# EAGLE design boat4 (EAGLE 6.4)
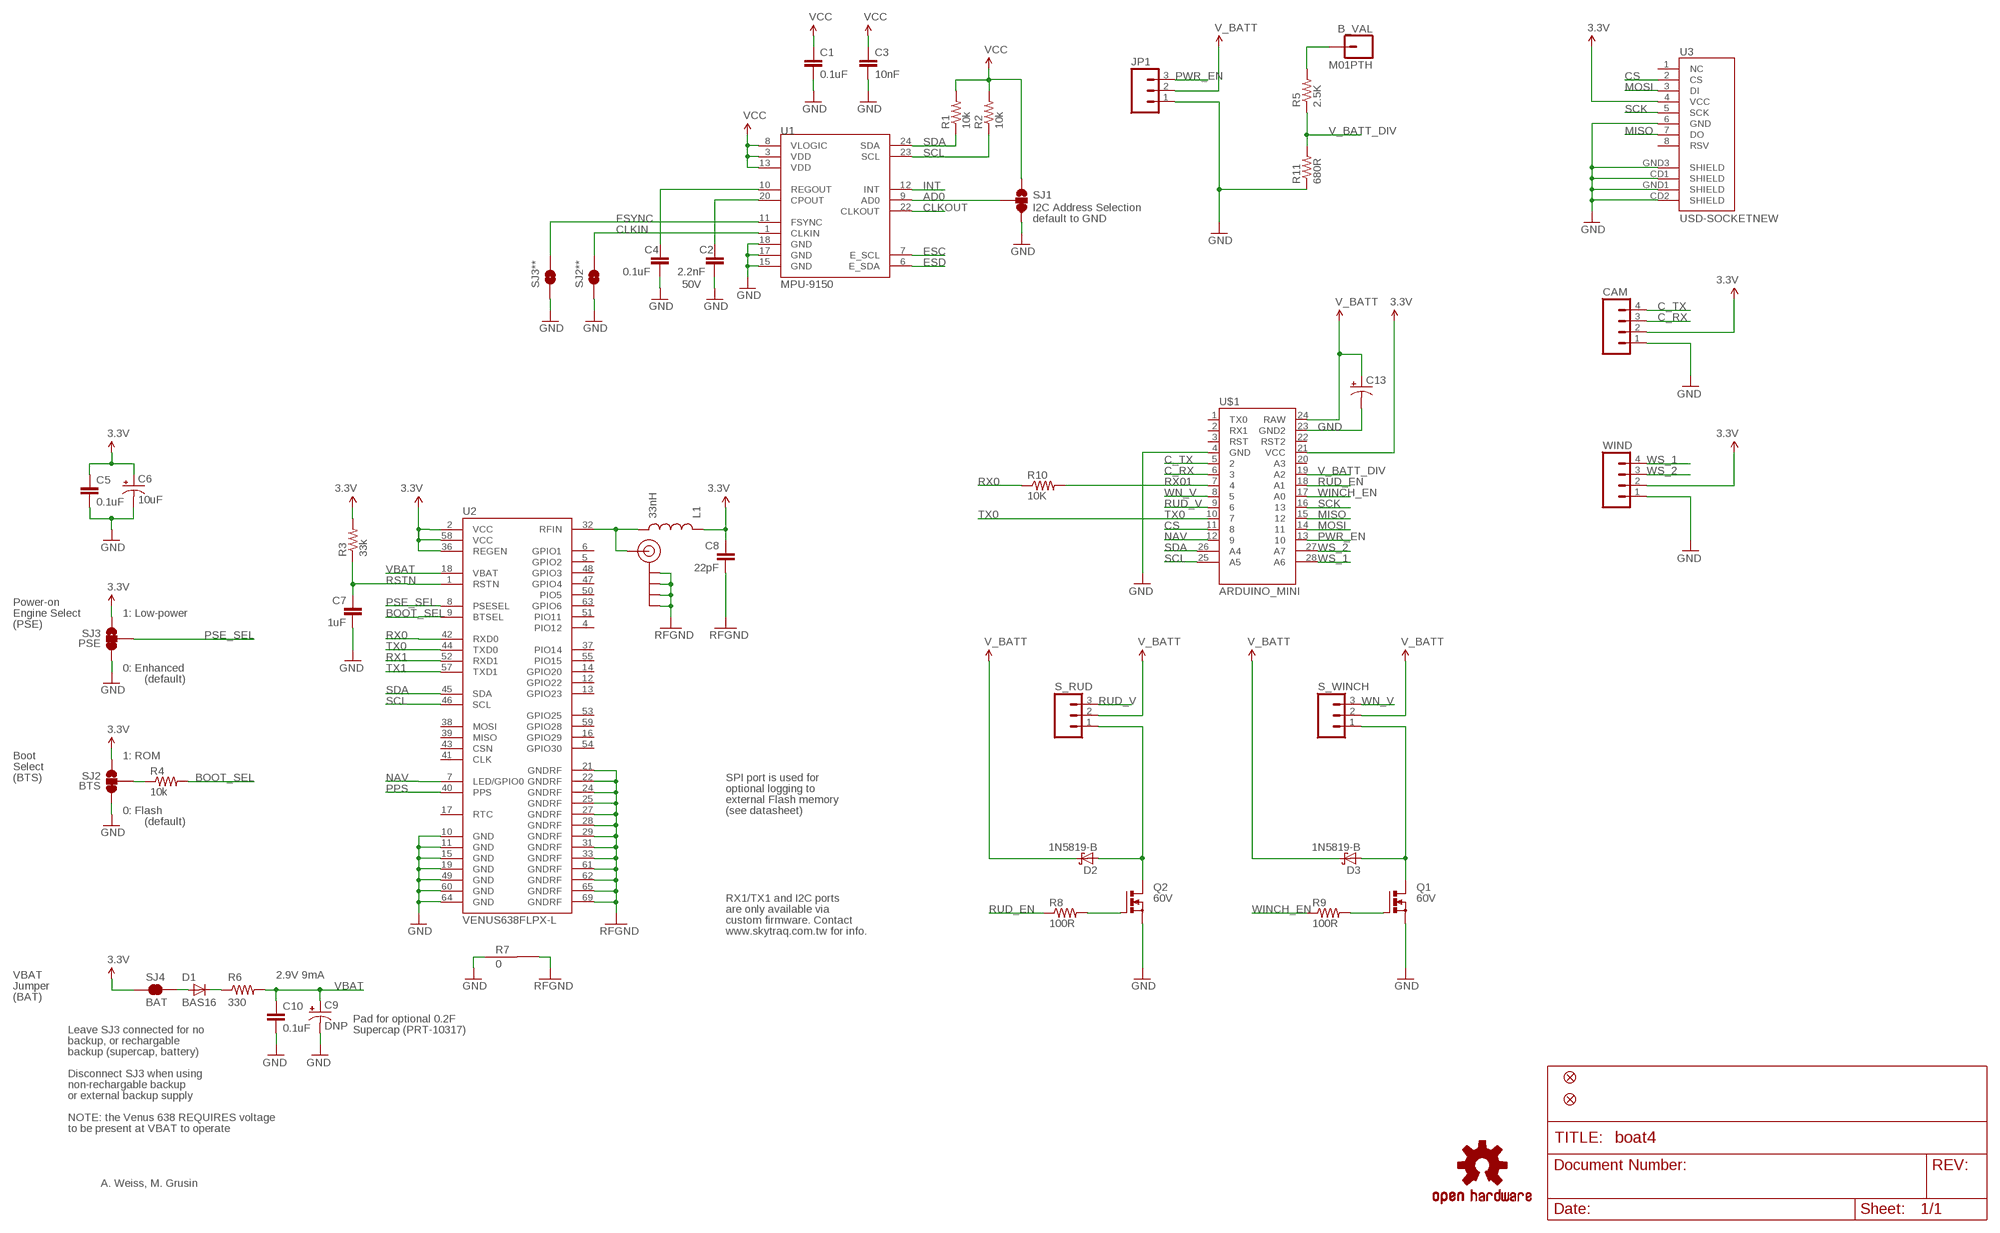
[diagram p0: schematic, sheet 1]

## Parts
B_VAL  M01PTH  [1X01]
C1  0.1uF  CAP0402-CAP  [0402-CAP]
C2  2.2nF  CAP0402-CAP  [0402-CAP]
C3  10nF  CAP0402-CAP  [0402-CAP]
C4  0.1uF  CAP0402-CAP  [0402-CAP]
C5  0.1uF  CAP0402-CAP  [0402-CAP]
C6  10uF  CAP_POL1206  [EIA3216]
C7  1uF  CAP0402-CAP  [0402-CAP]
C8  22pF  CAP0402-CAP  [0402-CAP]
C9  DNP  CAP_POLPTH4  [CPOL-RADIAL-1000UF-25V]
C10  0.1uF  CAP0402-CAP  [0402-CAP]
C13  CAP_POLPTH4  [CPOL-RADIAL-1000UF-25V]
CAM  M04PTH  [1X04]
D1  BAS16  DIODESOD  [SOD-323]
D2  1N5819-B  [DO41-7.6]
D3  1N5819-B  [DO41-7.6]
JP1  M03SCREW  [SCREWTERMINAL-3.5MM-3]
JP5  SMA_EDGE  [SMA-EDGE]
JP7  FIDUCIALUFIDUCIAL  [MICRO-FIDUCIAL]
JP8  FIDUCIALUFIDUCIAL  [MICRO-FIDUCIAL]
L1  33nH  INDUCTOR0402  [C0402]
Q1  60V  PMOSFET_NTO220BV  [TO220BV]
Q2  60V  PMOSFET_NTO220BV  [TO220BV]
R1  10k  RESISTOR0402-RES  [0402-RES]
R2  10k  RESISTOR0402-RES  [0402-RES]
R3  33k  RESISTOR0402-RES  [0402-RES]
R4  10k  RESISTOR0402-RES  [0402-RES]
R5  2.5K  RESISTOR0603-RES  [0603-RES]
R6  330  RESISTOR0402-RES  [0402-RES]
R7  0  GND-JUMP  [GND-JUMP]
R8  100R  RESISTOR0603  [0603-RES]
R9  100R  RESISTOR0603  [0603-RES]
R10  10K  RESISTOR0402-RES  [0402-RES]
R11  680R  RESISTOR0603-RES  [0603-RES]
S_RUD  M03PTH  [1X03]
S_WINCH  M03PTH  [1X03]
SJ1  SOLDERJUMPER_2WAYPASTE2&3  [SJ_3_PASTE2&3]
SJ2  BTS  SOLDERJUMPER_2WAYPASTE2&3  [SJ_3_PASTE2&3]
SJ2**  SOLDERJUMPERTRACE  [SJ_2S-TRACE]
SJ3  PSE  SOLDERJUMPER_2WAYPASTE2&3  [SJ_3_PASTE2&3]
SJ3**  SOLDERJUMPERTRACE  [SJ_2S-TRACE]
SJ4  BAT  SOLDERJUMPERNC  [SJ_2S]
U1  MPU-9150  MPU-9150QFN-24-NP  [QFN-24-NP]
U2  VENUS638FLPX-L  [VENUS638FLPX]
U3  USD-SOCKETNEW  [MICRO-SD-SOCKET-PP]
U$1  ARDUINO_MINI  [ARDUINO_MINI]
U$4  OSHW-LOGOS  [OSHW-LOGO-S]
WIND  M04PTH  [1X04]

## Nets
3.3V: C1.1 C3.1 C5.1 C6.A(+) C8.1 CAM.2 L1.1 R1.2 R2.2 R3.2 SJ1.1 SJ2.1 SJ3.1 SJ4.1 U1.3(VDD) U1.8(VLOGIC) U1.13(VDD) U2.2(VCC) U2.36(REGEN) U2.58(VCC) U3.4(VCC) U$1.21(VCC) WIND.2 ; supply symbol labelled VCC
AD0: SJ1.2 U1.9(AD0)
ANT: JP5.SIG(SIGNAL) L1.2 U2.32(RFIN)
BOOT_SEL: R4.2 U2.9(BTSEL)
C_RX: CAM.3 U$1.6
C_TX: CAM.4 U$1.5
CLKIN: SJ2**.2 U1.1(CLKIN)
CLKOUT: U1.22(CLKOUT)
CS: U3.2(CS) U$1.11
ESC: U1.7(E_SCL)
ESD: U1.6(E_SDA)
FSYNC: SJ3**.2 U1.11(FSYNC)
GND: C1.2 C2.2 C3.2 C4.2 C5.2 C6.C(-) C7.2 C9.2(-) C10.2 C13.2(-) CAM.1 JP1.1 Q1.S Q2.S R7.1 R11.1 SJ1.3 SJ2**.1 SJ2.3 SJ3**.1 SJ3.3 U1.15(GND) U1.17(GND) U1.18(GND) U2.10(GND) U2.11(GND) U2.15(GND) U2.19(GND) U2.49(GND) U2.60(GND) U2.64(GND) U3.6(GND) U3.CD1(SHIELD) U3.CD2(SHIELD) U3.GND1(SHIELD) U3.GND3(SHIELD) U$1.4(GND) U$1.23(GND2) WIND.1
INT: U1.12(INT)
MISO: U3.7(DO) U$1.15
MOSI: U3.3(DI) U$1.14
N$1: C2.1 U1.20(CPOUT)
N$2: C4.1 U1.10(REGOUT)
N$3: B_VAL.1 R5.2
N$4: R4.1 SJ2.2
N$5: D1.1(C) R6.1
N$6: D1.2(A) SJ4.2
N$7: Q2.G R8.2
N$8: D3.A Q1.D S_WINCH.1
N$9: D2.A Q2.D S_RUD.1
N$10: Q1.G R9.2
NAV: U2.7(LED/GPIO0) U$1.12
PPS: U2.40(PPS)
PSE_SEL: SJ3.2 U2.8(PSESEL)
PWR_EN: JP1.3 U$1.13
RFGND: C8.2 JP5.GND@0(GND) JP5.GND@1(GND) JP5.GND@2(GND) JP5.GND@3(GND) R7.2 U2.21(GNDRF) U2.22(GNDRF) U2.24(GNDRF) U2.25(GNDRF) U2.27(GNDRF) U2.28(GNDRF) U2.29(GNDRF) U2.31(GNDRF) U2.33(GNDRF) U2.61(GNDRF) U2.62(GNDRF) U2.65(GNDRF) U2.69(GNDRF)
RSTN: C7.1 R3.1 U2.1(RSTN)
RUD_EN: R8.1 U$1.18(A1)
RUD_V: S_RUD.3 U$1.9
RX0: R10.1 U2.42(RXD0)
RX1: U2.52(RXD1)
RX01: R10.2 U$1.7
SCK: U3.5(SCK) U$1.16
SCL: R2.1 U1.23(SCL) U2.46(SCL) U$1.25(A5)
SDA: R1.1 U1.24(SDA) U2.45(SDA) U$1.26(A4)
TX0: U2.44(TXD0) U$1.10
TX1: U2.57(TXD1)
V_BATT: C13.1(+) D2.C D3.C JP1.2 S_RUD.2 S_WINCH.2 U$1.24(RAW)
V_BATT_DIV: R5.1 R11.2 U$1.19(A2)
VBAT: C9.1(+) C10.1 R6.2 U2.18(VBAT)
WINCH_EN: R9.1 U$1.17(A0)
WN_V: S_WINCH.3 U$1.8
WS_1: U$1.28(A6) WIND.4
WS_2: U$1.27(A7) WIND.3
Unconnected: U2.4(PIO12) U2.5(GPIO2) U2.6(GPIO1) U2.12(GPIO22) U2.13(GPIO23) U2.14(GPIO20) U2.16(GPIO29) U2.17(RTC) U2.37(PIO14) U2.38(MOSI) U2.39(MISO) U2.41(CLK) U2.43(CSN) U2.47(GPIO4) U2.48(GPIO3) U2.50(PIO5) U2.51(PIO11) U2.53(GPIO25) U2.54(GPIO30) U2.55(PIO15) U2.59(GPIO28) U2.63(GPIO6) U3.1(NC) U3.8(RSV) U$1.1(TX0) U$1.2(RX1) U$1.3(RST) U$1.20(A3) U$1.22(RST2)

## Notes on the sheet
- I2C Address Selection
- default to GND
- 50V
- Power-on
- Engine Select | 1: Low-power
- (PSE)
- RFGND | RFGND
- 0: Enhanced
- (default)
- Boot | 1: ROM
- Select
- (BTS) | SPI port is used for
- optional logging to
- external Flash memory
- 0: Flash | (see datasheet)
- (default)
- RX1/TX1 and I2C ports
- are only available via
- custom firmware. Contact
- RFGND | www.skytraq.com.tw for info.
- VBAT | 2.9V 9mA
- Jumper | RFGND
- (BAT)
- Pad for optional 0.2F
- Leave SJ3 connected for no | Supercap (PRT-10317)
- backup, or rechargable
- backup (supercap, battery)
- Disconnect SJ3 when using
- non-rechargable backup
- or external backup supply
- NOTE: the Venus 638 REQUIRES voltage
- to be present at VBAT to operate
- A. Weiss, M. Grusin

## Library data of the parts
B_VAL = SparkFun-Connectors:M01: Header 1 Standard 1-pin 0.1" header. Use with straight break away headers (SKU : PRT-00116), right angle break away headers (PRT-00553), swiss pins (PRT-00743), machine pins (PRT-00117), and female headers (PRT-00115).
C1-C4 = SparkFun-Passives:CAP: Capacitor Standard 0603 ceramic capacitor, and 0.1" leaded capacitor.
C5 C7 C8 C10 = SparkFun:CAP: Capacitor Standard 0603 ceramic capacitor, and 0.1" leaded capacitor.
C6 C9 = SparkFun:CAP_POL: Capacitor Polarized These are standard SMD and PTH capacitors. Normally 10uF, 47uF, and 100uF in electrolytic and tantalum varieties. Always verify the external diameter of the through hole cap, it varies with capacity, voltage, and manufacturer. The EIA devices should be standard.
C13 = SparkFun-Passives:CAP_POL: Capacitor Polarized These are standard SMD and PTH capacitors. Normally 10uF, 47uF, and 100uF in electrolytic and tantalum varieties. Always verify the external diameter of the through hole cap, it varies with capacity, voltage, and manufacturer. The EIA devices should be standard.
CAM WIND = SparkFun-Connectors:M04: Header 4 Standard 4-pin 0.1" header. Use with straight break away headers (SKU : PRT-00116), right angle break away headers (PRT-00553), swiss pins (PRT-00743), machine pins (PRT-00117), and female headers (PRT-00115). Molex polarized connector foot print use with SKU : PRT-08231 with associated crimp pins and housings. 1MM SMD Version SKU: PRT-10208
D1 = SparkFun:DIODE: Diode These are standard reverse protection diodes and small signal diodes. SMA package can handle up to about 1A. SOD-323 can handle about 200mA. What the SOD-323 package when ordering, there are some mfgs out there that are 5-pin packages.
D2 D3 = diode:1N581*: 1.0A SCHOTTKY BARRIER RECTIFIER Source: http://www.diodes.com/datasheets/ds23001.pdf
JP1 S_RUD S_WINCH = SparkFun-Connectors:M03: Header 3 Standard 3-pin 0.1" header. Use with straight break away headers (SKU : PRT-00116), right angle break away headers (PRT-00553), swiss pins (PRT-00743), machine pins (PRT-00117), and female headers (PRT-00115). Molex polarized connector foot print use with SKU : PRT-08232 with associated crimp pins and housings.
JP5 = SparkFun:SMA_EDGE: SMA Antenna Connector End launch SMA connector. The paste layer has been removed so that the connector can be hand soldered onto the board after reflow.
JP7 JP8 = SparkFun:FIDUCIAL: Fiducial Alignment Points Various fiducial points for machine vision alignment.
L1 = SparkFun:INDUCTOR: Inductors Basic Inductor/Choke - 0603 and 1206. Footprints are not proven and vary greatly between part numbers.
Q1 Q2 = transistor-power:PMOSFET_N: Power MOSFET N-Channel
R1 R2 R5 R11 = SparkFun-Passives:RESISTOR: Resistor Basic schematic elements and footprints for 0603, 1206, and PTH resistors.
R3 R4 R6 R10 = SparkFun:RESISTOR: Resistor Basic schematic elements and footprints for 0603, 1206, and PTH resistors.
R7 = mike-temp:GND-JUMP: Zero-Ohm trace for connecting different ground planes at a single point.
R8 R9 = SparkFun-Resistors:RESISTOR: Resistor Basic schematic elements and footprints for 0603, 1206, and PTH resistors.
SJ1 = SparkFun-Passives:SOLDERJUMPER_2WAY: Solder Jumper 2 way solder jumper
SJ2 SJ3 = SparkFun:SOLDERJUMPER_2WAY: Solder Jumper 2 way solder jumper
SJ2** SJ3** = SparkFun-Passives:SOLDERJUMPER: Solder Jumper Standard SMD solder jumper. Used to automate production. Two varients : Normally Open and Normally Closed are the same, but have different paste layers. NC will have a large amount of paste and should jumper during reflow.
SJ4 = SparkFun:SOLDERJUMPER: Solder Jumper Standard SMD solder jumper. Used to automate production. Two varients : Normally Open and Normally Closed are the same, but have different paste layers. NC will have a large amount of paste and should jumper during reflow.
U1 = SparkFun-Sensors:MPU-9150: 9DOF (3mag, 3accel, 3rotat). I2C interface.
U2 = mike-temp:VENUS638FLPX-L: Venus638FLPX-L GPS Receiver Venus638FLPx is a high performance, low cost, single chip GPS receiver targeting mobile consumer and cellular handset applications. It offers very low power consumption, high sensitivity, and best in class signal acquisition and time-to-first-fix performance. Venus638FLPx contains all the necessary components of a complete GPS receiver, includes 1.2dB cascaded system NF RF front-end, GPS baseband signal processor, 0.5ppm TCXO, 32.768kHz RTC crystal, RTC LDO regulator, and passive components. It requires very low external component count and takes up only 100mm2 PCB footprint. Dedicated massive-correlator signal parameter search engine within the baseband enables rapid search of all the available satellites and acquisition of very weak signal. An advanced track engine allows weak signal tracking and positioning in harsh environments such as urban canyons and under deep foliage. The self-contained architecture keeps GPS processing off the host and allows integration into applications with very little resource. FEATURES 20Hz update rate -148dBm cold start sensitivity -165dBm tracking sensitivity 29 second cold start TTFF 3.5 second TTFF with AGPS 1 second hot start 2.5m accuracy Multipath detection and suppression Jamming detection and mitigation SBAS (WAAS / EGNOS) support 7-day extended ephemeris AGPS 67mW full power navigation Works directly with active or passive antenna Internal flash for optional 75K point data logging Supports external SPI flash memory data logging Complete receiver in 10mm x 10mm x 1.3mm size Contains LNA, SAW Filter, TCXO, RTC Xtal, LDO Pb-free RoHS compliant
U3 = SparkFun:USD-SOCKET: microSD Socket Push-push type uSD socket. Schematic element and footprint production proven. Spark Fun Electronics SKU : PRT-00127. tDoc lines correctly indicate media card edge positions when inserting (unlocked, locked, depressed).
U$1 = custom_mini:ARDUINO_MINI: Arduino Pro Mini footprint
U$4 = SparkFun:OSHW-LOGO: Open Source Hardware Logo This logo indicates the piece of hardware it is found on incorporates a OSHW license and/or adheres to the definition of open source hardware found here: http://freedomdefined.org/OSHW

## Board
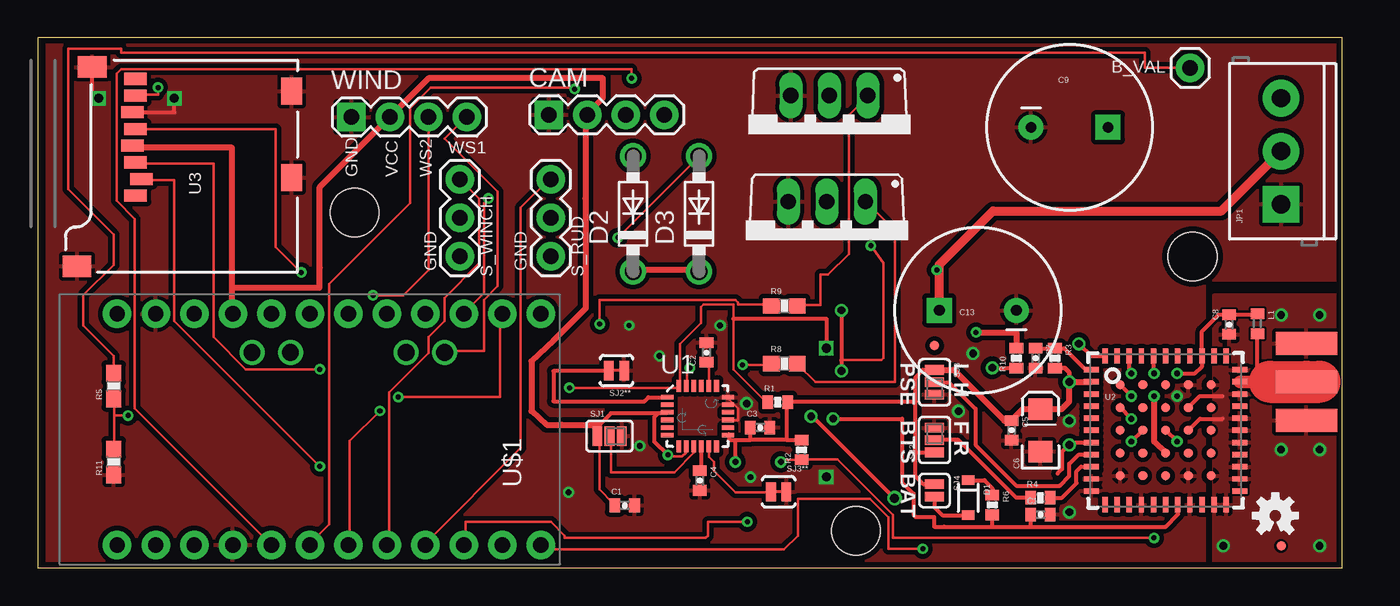
[diagram p1: board, top side]
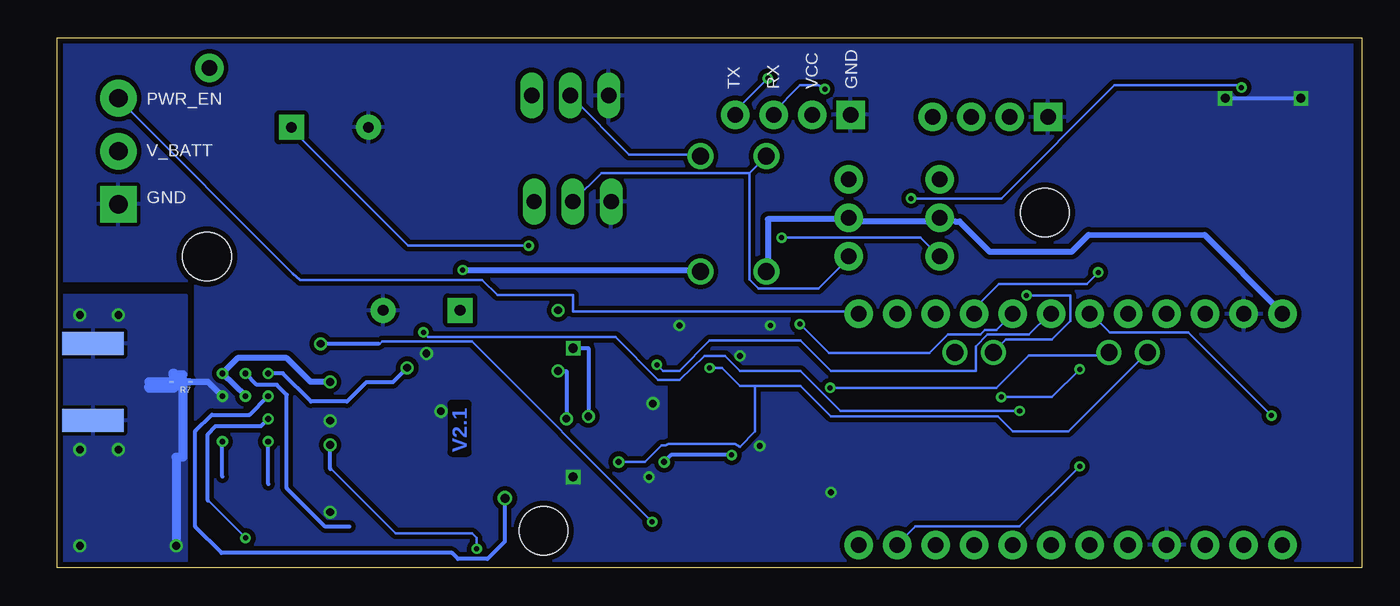
[diagram p2: board, bottom side, seen from below]

Size 86.03 x 34.98 mm. Coordinates in mm from the lower left corner, seen from the top.
Outline: 0,0 86.03,0 86.03,34.98 0,34.98 0,0
Copper layers (1*16): Top 0.0356mm / dielectric 1.5011mm / Bottom 0.0356mm
Design rules "LaenPCBOrder *": minimum track width 6mil, minimum drill 13mil, track to track 6mil, track to pad 6mil, pad to pad 6mil, via to via 6mil, smd to smd 6mil, copper to edge 15mil, drill to drill 6mil, minimum pad ring 7mil, minimum via ring 7mil, stop-mask expansion 3mil, vias tented up to drill 15mil, thermal gap 10mil
Holes 3.2 mm at 20.89,23.45 53.96,2.45 76.16,20.54
bRestrict: area 42,8.7 to 45.2,12

### Footprints (pad centres in the part's own frame; a part is rotated, then mirrored left to right if it is on the bottom)
1X01 = drill 1.016 pad 1.88: 1 0,0
0402-CAP = smd 0.7 x 0.9: 1 -0.65,0; 2 0.65,0
EIA3216 = smd 1.4 x 1.6: A 1.4,0; C -1.4,0
CPOL-RADIAL-1000UF-25V = drill 0.7 pad 1.651 square: 1 2.54,0 | drill 0.7 pad 1.651: 2 -2.54,0
1X04 = drill 1.016 pad 1.88 square: 1 0,0 | drill 1.016 pad 1.88: 2 2.54,0; 3 5.08,0; 4 7.62,0
SOD-323 = smd 0.63 x 0.83: 1 -1.15,0; 2 1.15,0
DO41-7.6 = drill 1.1 pad 1.7: A 3.81,0; C -3.81,0
SCREWTERMINAL-3.5MM-3 = drill 1.2 pad 2.413 square: 1 0,0 | drill 1.2 pad 2.413: 2 3.5,0; 3 7,0
SMA-EDGE = smd 1.524 x 4.064: GND@0 0,0; GND@1 5.08,0; SIG 2.54,0 | smd 1.524 x 4.064 bottom: GND@2 0,0; GND@3 5.08,0
MICRO-FIDUCIAL = smd 0.635 x 0.635: 1 0,0
C0402 = smd 0.7 x 0.9: 1 -0.65,0; 2 0.65,0
TO220BV = drill 1.016 long: D 0,-2.54; G -2.54,-2.54; S 2.54,-2.54
0402-RES = smd 0.7 x 0.9: 1 -0.65,0; 2 0.65,0
0603-RES = smd 1.1 x 1: 1 -0.85,0; 2 0.85,0
GND-JUMP = smd 0.305 x 0.152: 1 -0.635,0; 2 0.635,0
1X03 = drill 1.016 pad 1.88: 1 0,0; 2 2.54,0; 3 5.08,0
SJ_3_PASTE2&3 = smd 0.635 x 1.27: 1 -0.813,0; 2 0,0; 3 0.813,0
SJ_2S-TRACE = smd 0.635 x 1.27: 1 -0.508,0; 2 0.508,0
SJ_2S = smd 0.635 x 1.27: 1 -0.412,0; 2 0.412,0
QFN-24-NP = smd 0.8 x 0.3: 1 -2,1.25; 2 -2,0.75; 3 -2,0.25; 4 -2,-0.25; 5 -2,-0.75; 6 -2,-1.25; 13 2,-1.25; 14 2,-0.75; 15 2,-0.25; 16 2,0.25; 17 2,0.75; 18 2,1.25 | smd 0.3 x 0.8: 7 -1.25,-2; 8 -0.75,-2; 9 -0.25,-2; 10 0.25,-2; 11 0.75,-2; 12 1.25,-2; 19 1.25,2; 20 0.75,2; 21 0.25,2; 22 -0.25,2; 23 -0.75,2; 24 -1.25,2
VENUS638FLPX = smd 1 x 0.36: 1 -4.9,4; 2 -4.9,3.2; 3 -4.9,2.4; 4 -4.9,1.6; 5 -4.9,0.8; 6 -4.9,0; 7 -4.9,-0.8; 8 -4.9,-1.6; 9 -4.9,-2.4; 10 -4.9,-3.2; 11 -4.9,-4; 23 4.9,-4; 24 4.9,-3.2; 25 4.9,-2.4; 26 4.9,-1.6; 27 4.9,-0.8; 28 4.9,0; 29 4.9,0.8; 30 4.9,1.6; 31 4.9,2.4; 32 4.9,3.2; 33 4.9,4 | smd 0.36 x 1: 12 -4,-4.9; 13 -3.2,-4.9; 14 -2.4,-4.9; 15 -1.6,-4.9; 16 -0.8,-4.9; 17 0,-4.9; 18 0.8,-4.9; 19 1.6,-4.9; 20 2.4,-4.9; 21 3.2,-4.9; 22 4,-4.9; 34 4,4.9; 35 3.2,4.9; 36 2.4,4.9; 37 1.6,4.9; 38 0.8,4.9; 39 0,4.9; 40 -0.8,4.9; 41 -1.6,4.9; 42 -2.4,4.9; 43 -3.2,4.9; 44 -4,4.9 | smd 0.6 x 0.6: 45 -3,3; 46 -3,1.5; 47 -3,0; 48 -3,-1.5; 49 -3,-3; 50 -1.5,3; 51 -1.5,1.5; 52 -1.5,0; 53 -1.5,-1.5; 54 -1.5,-3; 55 0,3; 56 0,1.5; 57 0,0; 58 0,-1.5; 59 0,-3; 60 1.5,3; 61 1.5,1.5; 62 1.5,0; 63 1.5,-1.5; 64 1.5,-3; 65 3,3; 66 3,1.5; 67 3,0; 68 3,-1.5; 69 3,-3
MICRO-SD-SOCKET-PP = smd 0.8 x 1.5: 1 -8.94,10.7; 2 -7.84,10.3; 3 -6.74,10.7; 4 -5.64,10.9; 5 -4.54,10.7; 6 -3.44,10.9; 7 -2.34,10.7; 8 -1.24,10.7 | smd 1.8 x 1.4: CD1 -2.05,0.4; CD2 -7.75,0.4 | smd 1.4 x 1.9: GND1 -13.6,14.55; GND3 -0.45,13.55
ARDUINO_MINI = drill 1.016 pad 1.88: 1 -7.62,12.7; 2 -7.62,10.16; 3 -7.62,7.62; 4 -7.62,5.08; 5 -7.62,2.54; 6 -7.62,0; 7 -7.62,-2.54; 8 -7.62,-5.08; 9 -7.62,-7.62; 10 -7.62,-10.16; 11 -7.62,-12.7; 12 -7.62,-15.24; 13 7.62,-15.24; 14 7.62,-12.7; 15 7.62,-10.16; 16 7.62,-7.62; 17 7.62,-5.08; 18 7.62,-2.54; 19 7.62,0; 20 7.62,2.54; 21 7.62,5.08; 22 7.62,7.62; 23 7.62,10.16; 24 7.62,12.7 | drill 1.1: 25 5.08,3.81; 26 5.08,1.27; 27 5.08,-6.35; 28 5.08,-8.89

### Placement (x,y rotation side)
B_VAL  76,33 0 top
C1  38.7,4.13 0 top
C2  44.1,14.22 90 top
C3  47.63,9.27 0 top
C4  43.66,5.77 270 top
C5  64.22,9.08 270 top
C6  66.12,9.08 90 top
C7  65.81,13.84 270 top
C8  78.57,16.07 270 top
C9  68.05,29.08 0 top
C10  66.12,3.52 0 top
C13  62,17 180 top
CAM  33.7,29.91 0 top
D1  61.36,4.63 270 top
D2  39.26,23.37 90 top
D3  43.61,23.37 90 top
JP1  82,24 90 top
JP5  83.68,9.74 90 top
JP7  82,1.46 0 top
JP8  59.14,14.67 0 top
L1  80.44,16.12 270 top
Q1  52.2,28.64 180 top
Q2  52.04,21.64 180 top
R1  48.8,10.94 0 top
R2  50.37,7.79 90 top
R3  67.08,13.84 270 top
R4  66.12,4.63 0 top
R5  5,12 90 top
R6  62.95,4.16 270 top
R7  77.87,12.28 180 bottom
R8  49.23,13.48 0 top
R9  49.23,17.29 0 top
R10  64.54,13.84 90 top
R11  5,7 90 top
S_RUD  33.83,20.56 90 top
S_WINCH  27.83,20.56 90 top
SJ1  37.7,8.7 0 top
SJ2  59.14,8.45 90 top
SJ2**  38.16,13.02 180 top
SJ3  59.14,12.26 270 top
SJ3**  48.86,5.02 180 top
SJ4  59.14,5.11 270 top
U1  43.51,10.02 0 top
U2  74.38,9.08 0 top
U3  17.13,33.51 90 top
U$1  17.93,9.14 90 top
U$4  81.61,3.45 0 top
WIND  20.68,29.76 0 top

### Tracks (layer width: path | path; a pad name or v marks a point on that pad's centre or on a via)
3.3V  (via drill 0.33, 0.38, 0.4, 0.51)
  Top 0.152: C1.1 37.95,4.27 37.03,5.18 37.03,8.69 SJ1.1 37.03,8.84 37.03,9.45 | 49.38,10.82 R1.2 49.53,10.97 | 42.67,8.08 U1.8 42.76,7.61 42.5,7.35 41.65,7.35 v41.55,7.45 | 45.41,8.84 U1.13 45.57,8.84 | 41.45,10.21 U1.3 41.6,10.21 40.91,10.21 | 23.32,29.87 WIND.2 23.16,29.72 | 6.25,27.74 U3.4 | 12.8,16.92 U$1.21 | 36.12,29.87 CAM.2
  Top 0.254: SJ3.1 58.37,13.07 57.88,12.59 57.88,10.97 | U2.58 74.38,7.5 | v75.14,12.84 76.32,12.84 76.79,13.31 U2.36 76.78,15.61 77.89,16.71 C8.1 80.39,16.71 L1.1 | 57.88,7.63 SJ2.1 | 57.88,7.63 57.88,10.97 | 57.88,7.63 57.88,6.05 58.41,5.52 SJ4.1 | 64.12,9.83 C5.1 | 37.03,9.45 37.8,10.21 41.45,10.21 | 57.88,10.97 49.53,10.97 | 40.91,10.21 40.65,9.95 40.65,8.35 v41.55,7.45 | 49.38,10.82 49.38,8.45 | R2.2 49.38,8.44 49.38,8.45 | 49.38,8.45 47,8.45 | 47,8.45 47,9.27 C3.1 | 45.57,8.84 45.57,8.45 46,8.45 | 46,8.45 47,8.45 | v46,7 46,8.45
  Top 0.305: R3.2 67.73,13.19 68.03,12.89 v68.03,12.28
  Top 0.406: U2.58 73.62,8.34 v73.62,11.34 | SJ3.1 60.41,13.07 63.75,9.73 C5.1 64.97,10.48 C6.A 67.53,10.48 68.03,10.98 v68.03,12.28 U2.2 | 23.32,29.87 25.76,32.31 37.27,32.31 37.27,31.02 CAM.2 | 6.25,27.74 12.8,27.74 12.8,18.5 | 12.8,16.92 12.8,18.5 | 23.16,29.72 18.59,25.15 18.59,19.81 18.58,18.5 12.8,18.5 | 37.03,9.45 34.55,9.45 33.55,9.45 32.55,10.35 32.55,13.65 34,15 36.13,17.13 36.13,18.33 36.12,24.38 36.12,29.87
  Bottom 0.254: v41.55,7.45 45.55,7.45 v46,7
  Bottom 0.406: v73.62,11.34 v75.14,12.84 74.14,13.84 70.89,13.84 69.33,12.28 v68.03,12.28
AD0
  Top 0.152: U1.9 43.28,7.92 43.28,7.62 41.98,6.32 37.8,6.32 37.8,8.69 SJ1.2
ANT
  Top 0.254: L1.2 80.44,12.57 80.73,12.28 | JP5.SIG
  Top 0.813: U2.32 80.73,12.28 81.26,12.28
  Top 2.769: 84.54,12.28 JP5.SIG 81.26,12.28
BOOT_SEL
  Top 0.254: U2.9 68.82,6.69 68.51,6.38 68.51,5.59 67.55,4.63 R4.2
C_RX  (via drill 0.33)
  Top 0.152: v35.41,31.6 v35.4,31.6 35.3,31.7 25.91,31.7 24.54,30.33 24.54,24.08 19.2,18.75 19.2,2.9 17.98,1.68 U$1.6
  Bottom 0.152: v35.41,31.6 35.81,31.85 37.03,31.85 38.86,30.02 CAM.3
C_TX  (via drill 0.33)
  Top 0.152: v39.17,32.31 39.17,32.92 5.49,32.92 5.18,32.61 5.18,24.23 6.4,23.01 6.4,10.52 15.24,1.68 U$1.5
  Bottom 0.152: v39.17,32.31 41.45,30.02 CAM.4
CLKIN
  Top 0.254: SJ2**.2 37.63,13 34,13 34,11 40,11 40.27,11.27 U1.1
CS  (via drill 0.33)
  Top 0.152: v18.59,6.71 8.99,16.31 8.99,25.6 6.86,25.6 U3.2
  Bottom 0.152: v18.59,6.71 22.55,2.74 29.41,2.74 30.48,1.68 U$1.11
FSYNC
  Top 0.152: U1.11 44.26,7.34 44.6,7 44.6,6.4 46,5 48.33,5 SJ3**.2
GND  (via drill 0.33, 0.38, 0.5, 0.51, 0.6)
  Top 0.152: U1.15 45.57,9.75 46.18,9.75 46.18,10.52 45.57,11.12 U1.18 | 51.82,5.64 v52,6
  Top 0.254: U3.6 9,30.07 v9,31 | v4,31 3.58,31 U3.GND3
  Bottom 0.254: v9,31 v4,31
  Bottom 0.406: 76.08,12.28 U2.60 v75.14,11.34
  Bottom 0.445: R7.1 76.08,12.28
  other vias: 60.73,10.35 68.03,9.71 68.03,3.68 61.68,14.16 35,5 41,14 47,6 45,16 39.7,8.05 46.75,10.85 39,16
  pour Bottom (isolate 0.305): 0.6,34.97 86,35 86,18.97 76.92,18.97 76.92,0.19 0.6,0.19
  pour Top (isolate 0.305): 0.6,34.97 86,35 86,18.97 76.92,18.97 76.92,0.19 0.6,0.19
MISO  (via drill 0.33)
  Top 0.152: v7.92,31.7 7.92,31.24 6.55,31.24 U3.7 | v29.72,24.38 29.41,24.08 29.41,18.14 28.19,16.92 U$1.15
  Bottom 0.152: v7.92,31.7 8.08,31.85 16.31,31.85 23.77,24.38 v29.72,24.38
MOSI  (via drill 0.33)
  Top 0.152: v18.59,13.11 13.72,13.11 11.58,15.24 11.58,26.67 6.55,26.67 U3.3 | v23.77,11.28 30.48,11.28 30.48,16.76 U$1.14
  Bottom 0.152: v18.59,13.11 20.42,11.28 v23.77,11.28
N$1
  Top 0.152: U1.20 44.26,13.41 C2.1
N$2
  Top 0.254: 43.76,6.42 U1.10
  Top 0.406: C4.1 43.76,6.42
N$3
  Top 0.152: R5.2 5,14 3,16 3,18 5,20 5,22 2,25 2,34.25 5.5,34.25 5.5,34 73,34 73,33 B_VAL.1
N$4
  Top 0.254: SJ2.2 60.73,8.45 64.54,4.63 R4.1
N$5
  Top 0.254: D1.1 62.44,5.79 62.95,5.27 R6.1
N$6
  Top 0.254: D1.2 59.66,3.48 59.14,4 SJ4.2
N$7
  Top 0.152: R8.2 50.14,13.41 51.27,12.28 56.54,12.28 56.54,22.25 54.71,24.08 Q2.G
N$8  (via drill 0.33)
  Top 0.152: v38.25,21.79 43.59,27.13 D3.A
  Bottom 0.152: Q1.D 52.12,31.09 48.31,27.28 43.74,27.28 D3.A | v38.25,21.79 29.11,21.79 27.89,20.57 S_WINCH.1
N$9
  Top 0.152: 33.83,20.57 S_RUD.1
  Bottom 0.152: 40.39,26.06 50.14,26.06 51.97,24.23 Q2.D | 40.39,26.06 39.32,27.13 D2.A | 40.39,26.06 40.39,19.05 39.78,18.44 35.81,18.44 33.83,20.42 S_RUD.1
N$10
  Top 0.152: R9.2 50.14,17.37 50.45,17.25 50.45,17.35 51.6,17.35 51.6,19.36 52.12,19.36 53.49,20.73 53.49,29.87 54.71,31.09 Q1.G
NAV  (via drill 0.33, 0.51)
  Top 0.152: v58.37,1.27 56.08,1.27 56.08,3.35 54.86,4.57 50.14,4.57 50.14,2.13 49.23,1.22 33.22,1.22 33.22,1.52 U$1.12
  Top 0.254: 67.25,6.24 67.55,6.54 67.55,7.65 v68.03,8.13 68.18,8.28 U2.7
  Bottom 0.152: v58.37,1.27 58.37,1.98 58.67,2.29 63.7,2.29 67.97,6.55 68.03,6.55
  Bottom 0.254: 68.03,6.54 68.03,6.55 v68.03,8.13
PPS  (via drill 0.38)
  Top 0.254: U2.40 73.59,12.89 v73.62,12.84
  Bottom 0.254: 66.76,2.73 68.35,2.73 70.89,5.27 70.89,11.42 71.55,12.09 72.87,12.09 v73.62,12.84
PSE_SEL
  Top 0.254: 68.67,7.48 68.03,6.87 68.03,6.06 67.39,5.43 64.54,5.43 61.84,8.13 61.84,10.51 60.09,12.26 SJ3.2 | 68.67,7.48 U2.8 | 68.67,7.48
PWR_EN
  Bottom 0.152: U$1.13 33.22,16.92 52,16.94 52,18 57,18 58,19 70,19 70.49,19.44 81.99,30.94 JP1.3
RFGND  (via drill 0.51)
  Top 0.254: U2.61 76.64,11.34 78.14,11.34 | U2.62 76.64,9.84 78.14,9.84
  Bottom 0.61: R7.2 80,12.28 80,12.25 77.75,12.25 77.75,12.75 78.4,12.75 78.4,12.85 78.35,12.85 78.35,11.85 80,11.85 80,12 77.75,12 77.75,7.3 78.19,7.3 v78.19,1.46
  other vias: 82,16.7 84.54,1.46 84.54,16.7 84.54,7.81 82,7.81
  pour Top: 77.56,17.97 77.56,0.19 85.81,0.19 85.81,17.97
  pour Bottom: 77.56,17.97 77.56,0.19 85.81,0.19 85.81,17.97
RSTN
  Top 0.254: C7.1 R3.1 67.7,14.49 69.11,13.08 U2.1
RUD_EN  (via drill 0.33)
  Top 0.152: v46.48,13.41 48.31,13.41 R8.1
  Bottom 0.152: v46.48,13.41 46.07,13 45,13 43,15 37,15 35,13 25.45,13 25.45,14.63 24.69,15.39 21.95,15.39 20.57,16.76 U$1.18
RUD_V
  Top 0.152: U$1.9 25.6,1.68 31.85,7.92 31.85,23.77 33.68,25.6 S_RUD.3
RX0  (via drill 0.38, 0.51)
  Top 0.254: U2.42 71.99,12.99 v72.12,12.84 | R10.1 62.97,13.19 v62.95,13.21
  Bottom 0.254: v72.12,12.84 71.15,12.84 69.3,10.98 66.92,10.98 65.65,12.26 63.9,12.26 v62.95,13.21
RX1  (via drill 0.38)
  Top 0.254: 72.81,9.08 U2.52 v72.12,8.34
  Bottom 0.254: 72.12,5.55 v72.12,8.34
RX01  (via drill 0.33)
  Top 0.152: v22.55,10.36 20.57,8.38 20.57,1.68 U$1.7
  Top 0.406: v61.87,15.54 64.54,15.54 R10.2
  Bottom 0.152: v61.87,15.54 61.57,15.24 49.23,15.24 46.4,12.41 46.4,12.4 45,12.4 43.35,14 42,14 41,13 37,13 34.36,10.36 v22.55,10.36
SCK  (via drill 0.33)
  Top 0.152: v17.37,19.51 15.7,21.18 15.7,28.96 6.55,28.96 U3.5
  Bottom 0.152: v17.37,19.51 18.14,18.75 23.93,18.75 25.45,17.22 25.45,16.92 U$1.16
SCL  (via drill 0.33, 0.38, 0.4)
  Top 0.152: U1.23 42.82,11.89 42.82,13.02 v43,13.2 | v73.61,1.98 56.39,1.98 56.39,3.5 52.73,7.16 50.39,7.16 R2.1 49.14,7.14 v49,7
  Top 0.254: v72.12,9.84 U2.46
  Bottom 0.152: U$1.25 14.17,14.17 19.35,9 23,9 24,10 35,10 37,12 40,12 | v73.61,1.98 76.05,4.42 76.11,4.46 | v43,13.2 42.2,13.2 41,12 40,12 | 40,12 40,9 41,8 41.33,8.18 45.7,8.2 45.92,8.08 46.18,8.08 47.25,7 v49,7
  Bottom 0.254: 76.11,4.46 76.11,8.83 75.59,9.37 72.6,9.37 v72.12,9.84
SDA  (via drill 0.33, 0.38, 0.5, 0.6)
  Top 0.152: R1.1 48.01,10.97 45.87,13.11 45.87,16.46 45.87,17.37 43.89,17.37 43.74,17.22 43.74,16.15 42.37,14.78 42.37,12.04 U1.24 42.22,11.89 v35.05,11.89
  Top 0.254: v72.12,11.34 U2.45 | 45.87,16.46 52,16.45 v52,14.5 | v51,10 51.1,10 v56.5,4.6
  Bottom 0.152: v35.05,11.89 24.08,11.89 21.95,14.02 16.92,14.02 16.76,14.17 U$1.26
  Bottom 0.254: v72.12,11.34 73.36,10.1 75.85,10.1 76.92,9.03 76.92,2.73 75.19,1 60,1 59.6,0.6 57.65,0.6 56.5,1.75 v56.5,4.6 | v51,10 51,14.5 v52,14.5
TX0  (via drill 0.33, 0.51)
  Top 0.152: v46.79,3.05 44.2,3.05 44.2,2.13 44.04,1.98 34.75,1.98 34.75,2.13 33.83,3.05 28.19,3.05 28.19,1.68 U$1.10
  Top 0.254: U2.44 69.48,13.98 v68.67,14.79
  Bottom 0.152: v46.79,3.05 58.67,14.94 64.62,14.94 64.77,14.78 64.86,14.79
  Bottom 0.254: 64.86,14.79 v68.67,14.79
TX1  (via drill 0.38)
  Top 0.254: v75.14,8.34 U2.57
  Bottom 0.254: 75.14,6.03 v75.14,8.34
V_BATT  (via drill 0.33)
  Top 0.152: 39.32,19.66 D2.C | 43.59,19.66 D3.C | v59.28,19.66 59.46,19.66
  Top 0.406: 43.59,19.66 39.32,19.66
  Top 0.61: JP1.2 78.06,23.56 63,23.56 59.46,20.02 59.46,19.66 C13.1
  Bottom 0.152: 26.82,22.86 26.98,23.01 27.74,23.01 S_WINCH.2 27.89,23.01 28.04,22.86 | 5.33,16.92 U$1.24 | 33.83,23.16 S_RUD.2 33.98,23.01 | 39.17,19.66 D2.C | 43.74,19.66 D3.C
  Bottom 0.406: 5.33,16.92 10.35,21.98 18,22 19.12,20.88 24.54,20.88 26.52,22.86 26.82,22.86 | 28.04,22.86 33.53,22.86 33.68,23.01 S_RUD.2 | 39.17,19.66 39.17,23.01 33.98,23.01 | v59.28,19.66 43.74,19.66
V_BATT_DIV  (via drill 0.33)
  Top 0.152: 5.03,10.06 5.03,11.12 R5.1 | 5.03,10.06 5.03,7.92 R11.2 | v5.94,10.06 5.03,10.06
  Bottom 0.152: v5.94,10.06 11.43,15.54 16.61,15.54 17.83,16.76 U$1.19
VBAT  (via drill 0.33, 0.5)
  Top 0.152: 59.13,2.74 59.14,2.73 | 53,13.72 55.63,13.72 55.78,13.87 55.78,20.12 v54.93,21.27
  Top 0.254: U2.18 75.19,3.54 74.38,2.73 65.49,2.73 | 59.14,2.73 59.77,2.73 | 59.77,2.73 62.95,2.73 | 62.95,2.73 65.49,2.73 | 62.95,2.73 R6.2 | 59.77,2.73 59.79,2.75 | C10.1 65.49,3.51 65.49,2.73 | 59.13,2.74 59.13,3.35 57.91,3.35 57.75,3.52 57.75,4.9 57,5.65 57,9.85 v52.45,9.85 | v53,17 53,13.72 v53,13
  Bottom 0.152: v54.93,21.27 62.87,21.27 70.56,28.96 C9.1
  Bottom 0.254: v53,13 52.45,13 v52.45,9.85
WINCH_EN  (via drill 0.33)
  Top 0.152: v37.05,16.09 37.05,17.68 46.02,17.68 46.18,17.53 46.18,17.37 48.31,17.37 R9.1
  Bottom 0.152: v37.05,16.09 35.14,14.17 28.5,14.17 27.28,15.39 25.15,15.39 24.84,15.7 24.08,15.7 U$1.17
WN_V
  Top 0.152: U$1.8 23.01,1.68 23.16,1.83 23.16,11.58 25.76,14.17 25.76,15.24 26.82,16.31 26.82,17.83 29.11,20.12 29.11,24.38 27.89,25.6 S_WINCH.3
WS_1
  Top 0.152: WIND.4 28.19,29.72 26.82,28.35 30.33,24.84 30.33,18.59 29.41,17.68 29.41,14.33 26.82,14.33 U$1.28
WS_2  (via drill 0.33)
  Top 0.152: WIND.3 25.76,29.72 25.76,19.66 24.08,17.98 v22.1,17.98
  Bottom 0.152: v22.1,17.98 19.2,17.98 19.2,16.31 20.42,15.09 23.47,15.09 24.23,14.33 U$1.27

### Text on the board
Bottom: V2.1
tPlace: PSE | L H | BTS | F R | BAT
tNames: WS1 | GND | VCC | WS2 | GND | GND
bNames: GND | VCC | RX | TX | PWR_EN | V_BATT | GND